# Altium project btn.PrjPcb
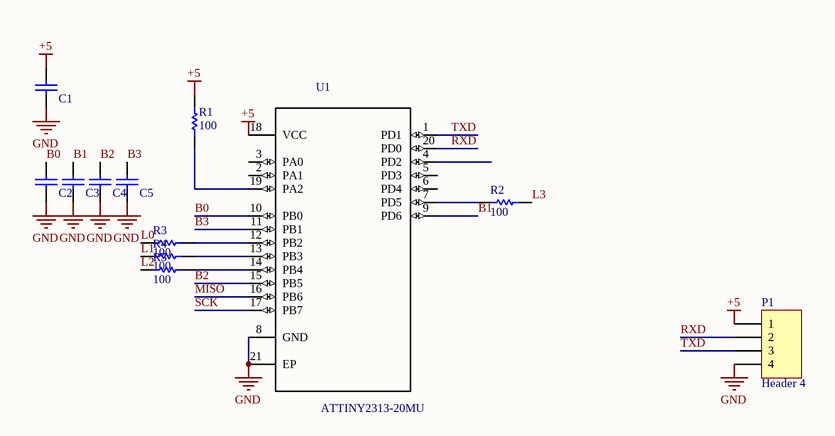
[diagram p0: btn.SchDoc]
1 sheet, 12 parts. Net scope: global (net labels, ports and power ports of the same name join across sheets).
Board file: btn.PcbDoc

## Sheet btn.SchDoc
size A4

### Parts
C1  Cap  [0603x]  (value not drawn)
C2  Cap  [0603x]  (value not drawn)
C3  Cap  [0603x]  (value not drawn)
C4  Cap  [0603x]  (value not drawn)
C5  Cap  [0603x]  (value not drawn)
P1  Header 4  [HDR1X4]
R1  value 100  [0402x]
R2  value 100  [0603x]
R3  value 100  [0603x]
R4  value 100  [0603x]
R5  value 100  [0603x]
U1  ATTINY2313-20MU  [*QFN50P400X400X80-21N]

### Nets
+5: C1.1 P1.1 R1.1 U1.18(VCC)
GND: C1.2 C2.2 C3.2 C4.2 C5.2 P1.4 U1.8(GND) U1.21(EP)
B0: C2.1 U1.10(PB0)
B1: C3.1 U1.9(PD6)
B2: C4.1 U1.15(PB5)
B3: C5.1 U1.11(PB1)
L0: R3.1
L1: R4.1
L2: R5.1
L3: R2.2
MISO: U1.16(PB6)
RXD: P1.2 U1.20(PD0)
SCK: U1.17(PB7)
TXD: P1.3 U1.1(PD1)
NetR1_2: R1.2 U1.19(PA2)
NetR2_1: R2.1 U1.7(PD5)
NetR3_2: R3.2 U1.12(PB2)
NetR4_2: R4.2 U1.13(PB3)
NetR5_2: R5.2 U1.14(PB4)

Not connected (* = marked no-connect by the designer): U1 2(PA1) 3(PA0) 4(PD2) 5(PD3) 6(PD4)

### Library data of the parts
C1-C5 = Cap: Capacitor; Value: 100nF; Published: 8-Jun-2000; LatestRevisionDate: 17-Jul-2002; LatestRevisionNote: Re-released for DXP Platform.; PackageReference: RAD-0.3; Publisher: Altium Limited; PackageDescription: Radial Cap, Thru-Hole; 2 Leads; 0.3 in Pin Spacing
P1 = Header 4: Header, 4-Pin; LatestRevisionDate: 17-Jul-2002; LatestRevisionNote: Re-released for DXP Platform.; Publisher: Altium Limited
R1-R5 = Res1: Resistor; Published: 8-Jun-2000; LatestRevisionDate: 17-Jul-2002; LatestRevisionNote: Re-released for DXP Platform.; PackageReference: AXIAL-0.3; Publisher: Altium Limited; PackageDescription: Axial Device, Thru-Hole; 2 Leads; 0.3 in Pin Spacing
U1 = ATTINY2313-20MU: ATtiny Series 20 MHz 2 KB Flash 128 B SRAM 8-Bit Microcontroller - QFN-20; MF: Microchip; Availability: Unavailable; SnapEDA_Link: https://www.snapeda.com/parts/ATTINY2313-20MU/Microchip/view-part/?ref=snap; MP: ATTINY2313-20MU; Package: QFN-20 Microchip; Price: None; Value: *